# EAGLE schematic HMTRPBreakoutModule (EAGLE 6.3)
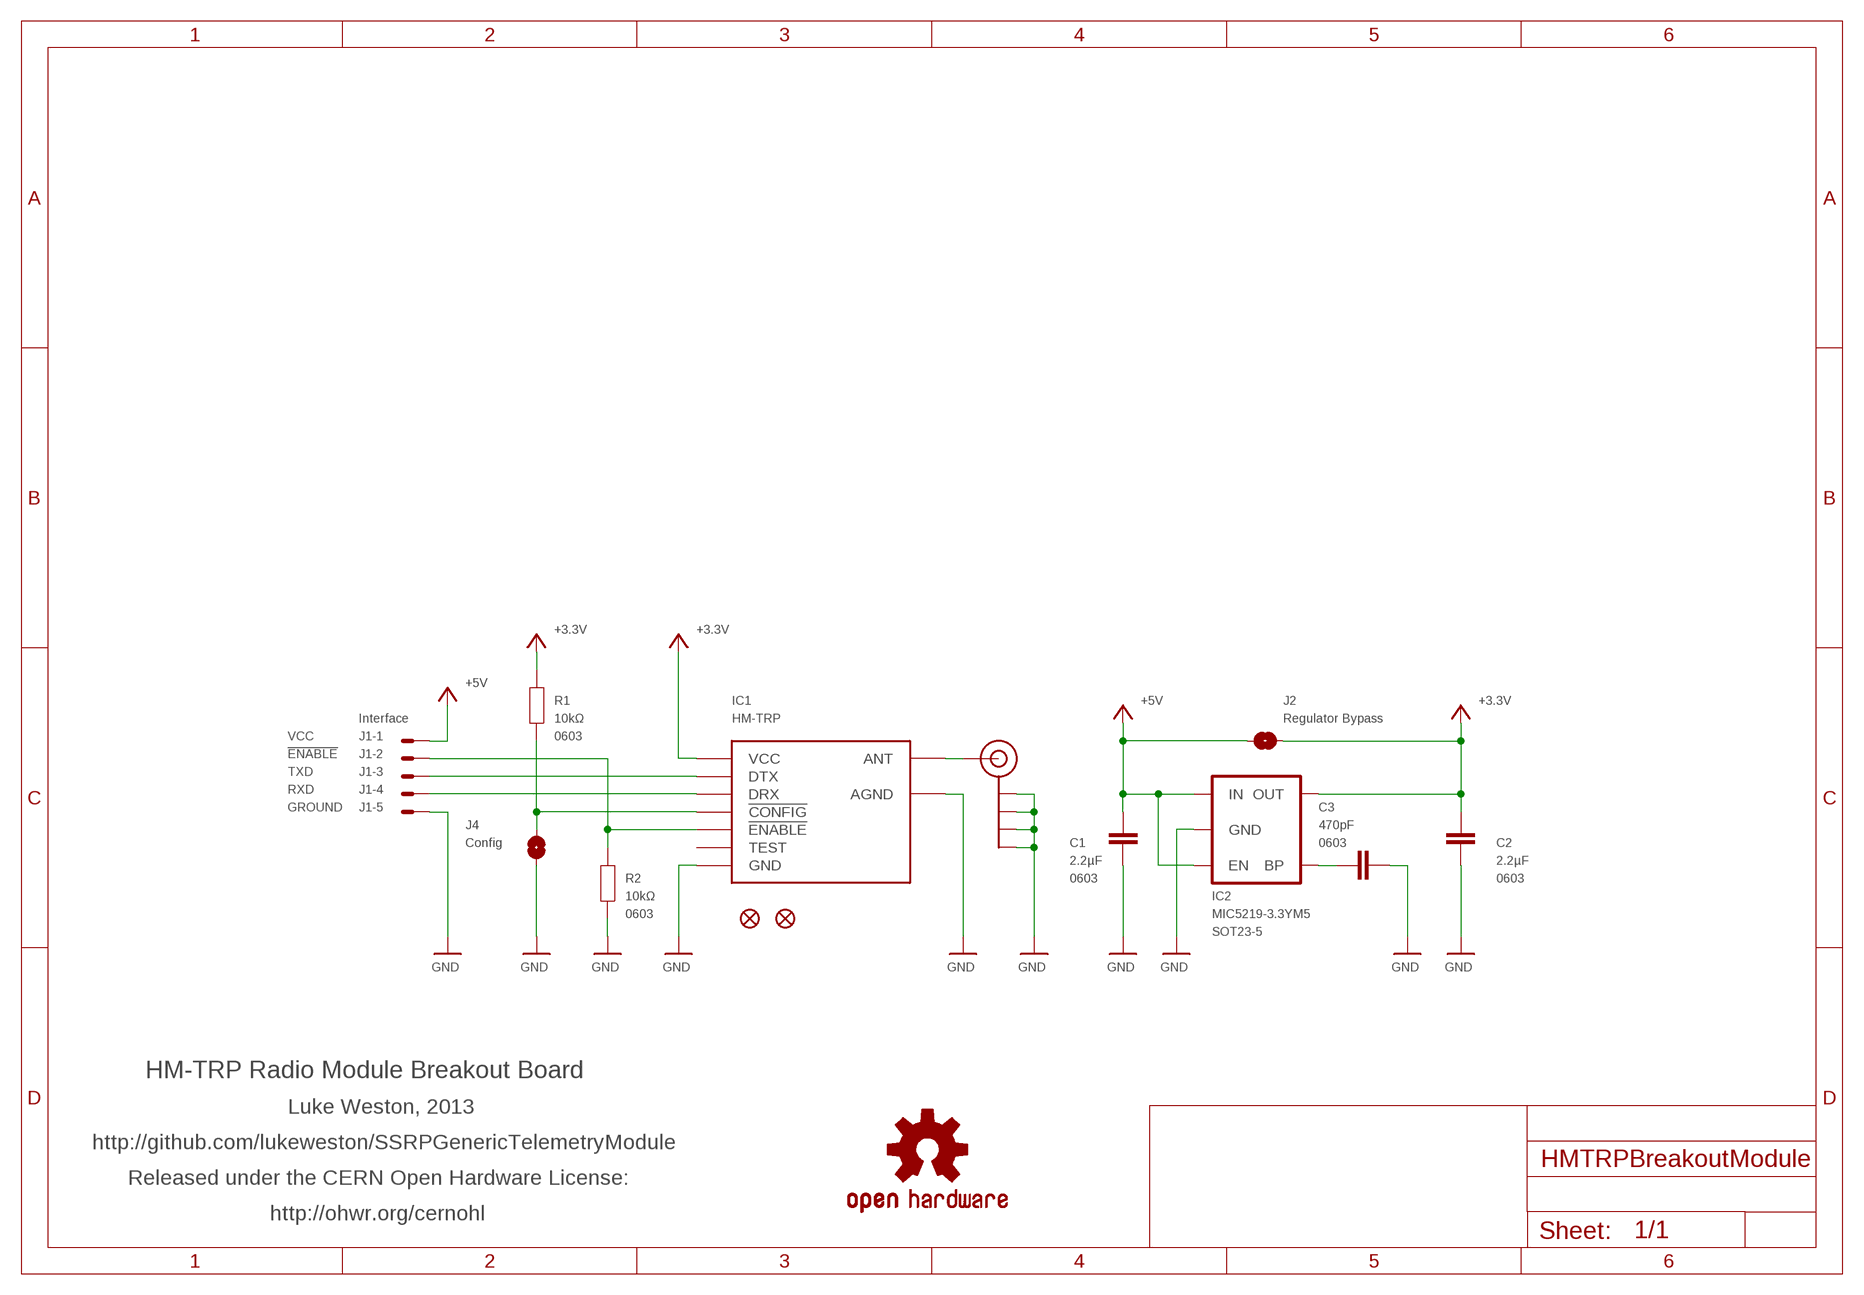
[diagram p0: schematic, sheet 1]

## Parts
C1  2.2µF  CAP0603  [0603]
C2  2.2µF  CAP0603  [0603]
C3  470pF  CAP0603  [0603]
IC1  HM-TRP  HM-TRPSMD  [HM-TRP-SMD]
IC2  MIC5219-3.3YM5  V_REG_LDOSMD  [SOT23-5]
J1  Interface  22-23-2051  [22-23-2051]
J2  Regulator Bypass  SJ  [SJ]
J3  Antenna  SMA_EDGE  [SMA-EDGE]
J4  Config  SJ  [SJ]
JP1  FIDUCIAL1X2  [FIDUCIAL-1X2]
JP2  FIDUCIAL1X2  [FIDUCIAL-1X2]
R1  10kΩ  RESISTOR0603  [0603]
R2  10kΩ  RESISTOR0603  [0603]
SY  OSHW-LOGOS  [OSHW-LOGO-S]

## Nets
+3V3: C2.1 IC1.VCC IC2.5(OUT) J2.2 R1.1 ; supply symbol labelled +3.3V
+5V: C1.1 IC2.1(IN) IC2.3(EN) J1.1 J2.1
GND: C1.2 C2.2 C3.1 IC1.AGND IC1.GND IC2.2(GND) J1.5 J3.GND@0(GND) J3.GND@1(GND) J3.GND@2(GND) J3.GND@3(GND) J4.1 R2.2
N$6: IC1.!ENABLE J1.2 R2.1
N$7: IC1.DTX J1.3
N$8: IC1.ANT J3.SIG(SIGNAL)
N$11: IC1.DRX J1.4
N$13: C3.2 IC2.4(BP)
N$14: IC1.!CONFIG J4.2 R1.2
Unconnected: IC1.TEST

## Notes on the sheet
- VCC
- !ENABLE
- TXD
- RXD
- GROUND
- HM-TRP Radio Module Breakout Board
- Luke Weston, 2013
- http://github.com/lukeweston/SSRPGenericTelemetryModule
- Released under the CERN Open Hardware License:
- http://ohwr.org/cernohl

## Library data of the parts
C1-C3 = freetronics-master-v1:CAP: Capacitor Standard 0603 ceramic capacitor, and 0.1" leaded capacitor.; PACKAGE: 0603
IC1 = 3DRobotics:HM-TRP: HM-TRP Series 100mW Transceiver module HM-TRP series is a low cost, high performance transparent FSK transceiver with operating at 433/470/868/915 MHz. It features small size, high output power, high sensitivity, long transmission distance and high communication data rate with auto set up for communication change and data receiving and transmission control. There is UART interface, it is easy to realize the wireless data transmission with only providing the UART data. It is flexible for the users to set the UART baud rate, frequency, output power, data rate, frequency deviation, receiving bandwidth etc parameters. It is your ideal choice for designing wireless data transmission products which can be widely used on wireless data transmission field.
IC2 = SparkFun:V_REG_LDO: Voltage Regulator LDO Standard 150mA LDO voltage regulator in SOT-23 layout. Micrel part MIC5205. BP (by-pass) pin is used to lower output noise with 470pF cap.; PACKAGE: SOT23-5
J1 = con-molex:22-23-2051: .100" (2.54mm) Center Header - 5 Pin; MF: MOLEX; MPN: 22-23-2051; OC_FARNELL: 1462952; OC_NEWARK: 38C9178
J2 J4 = freetronics-luke:SJ: PCB "solder jumper". Note that there should nothing on the BOM corresponding to this "component".
J3 = 3DRobotics:SMA_EDGE: SMA Antenna Connector End launch SMA connector. The paste layer has been removed so that the connector can be hand soldered onto the board after reflow.
JP1 JP2 = SparkFun:FIDUCIAL: Fiducial Alignment Points Various fiducial points for machine vision alignment.
R1 R2 = freetronics-master-v1:RESISTOR: Resistor Basic schematic elements and footprints for 0603, 1206, and PTH 1/10th watt (small) resistors.; PACKAGE: 0603
SY = SparkFun:OSHW-LOGO: Open Source Hardware Logo This logo indicates the piece of hardware it is found on incorporates a OSHW license and/or adheres to the definition of open source hardware found here: http://freedomdefined.org/OSHW

## Net classes
1 power: width 0.508 mm